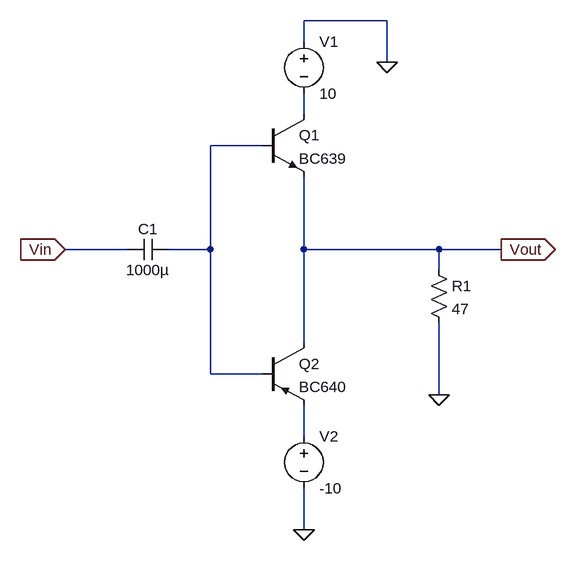
[diagram p0: schematic Draft1.asc]
Draft1.asc, the LTspice schematic file:
Version 4
SHEET 1 880 680
WIRE 272 -192 144 -192
WIRE 144 -160 144 -192
WIRE 272 -128 272 -192
WIRE 144 -48 144 -80
WIRE 80 0 0 0
WIRE -128 160 -224 160
WIRE 0 160 0 0
WIRE 0 160 -64 160
WIRE 144 160 144 48
WIRE 352 160 144 160
WIRE 448 160 352 160
WIRE 352 192 352 160
WIRE 144 304 144 160
WIRE 0 352 0 160
WIRE 80 352 0 352
WIRE 352 384 352 272
WIRE 144 448 144 400
WIRE 144 592 144 528
FLAG 352 384 0
FLAG 448 160 Vout
IOPIN 448 160 Out
FLAG -224 160 Vin
IOPIN -224 160 In
FLAG 144 592 0
FLAG 272 -128 0
SYMBOL res 336 176 R0
SYMATTR InstName R1
SYMATTR Value 47
SYMBOL cap -64 144 R90
WINDOW 0 0 32 VBottom 2
WINDOW 3 32 32 VTop 2
SYMATTR InstName C1
SYMATTR Value 1000µ
SYMBOL npn 80 -48 R0
SYMATTR InstName Q1
SYMATTR Value BC639
SYMBOL pnp 80 304 R0
SYMATTR InstName Q2
SYMATTR Value BC640
SYMBOL voltage 144 -176 R0
WINDOW 123 0 0 Left 0
WINDOW 39 0 0 Left 0
SYMATTR InstName V1
SYMATTR Value 10
SYMBOL voltage 144 432 R0
WINDOW 123 0 0 Left 0
WINDOW 39 0 0 Left 0
SYMATTR InstName V2
SYMATTR Value -10

The netlist it stands for:
* Draft1.asc
R1 Vout 0 47
C1 N002 Vin 1000µ
Q1 N001 N002 Vout 0 BC639
Q2 Vout N002 N003 0 BC640
V1 0 N001 10
V2 N003 0 -10
.model NPN NPN
.model PNP PNP
.lib standard.bjt
.backanno
.end